# Altium schematic sheet MCU.SchDoc
size A; SheetNumber: 2; SheetTotal: 15
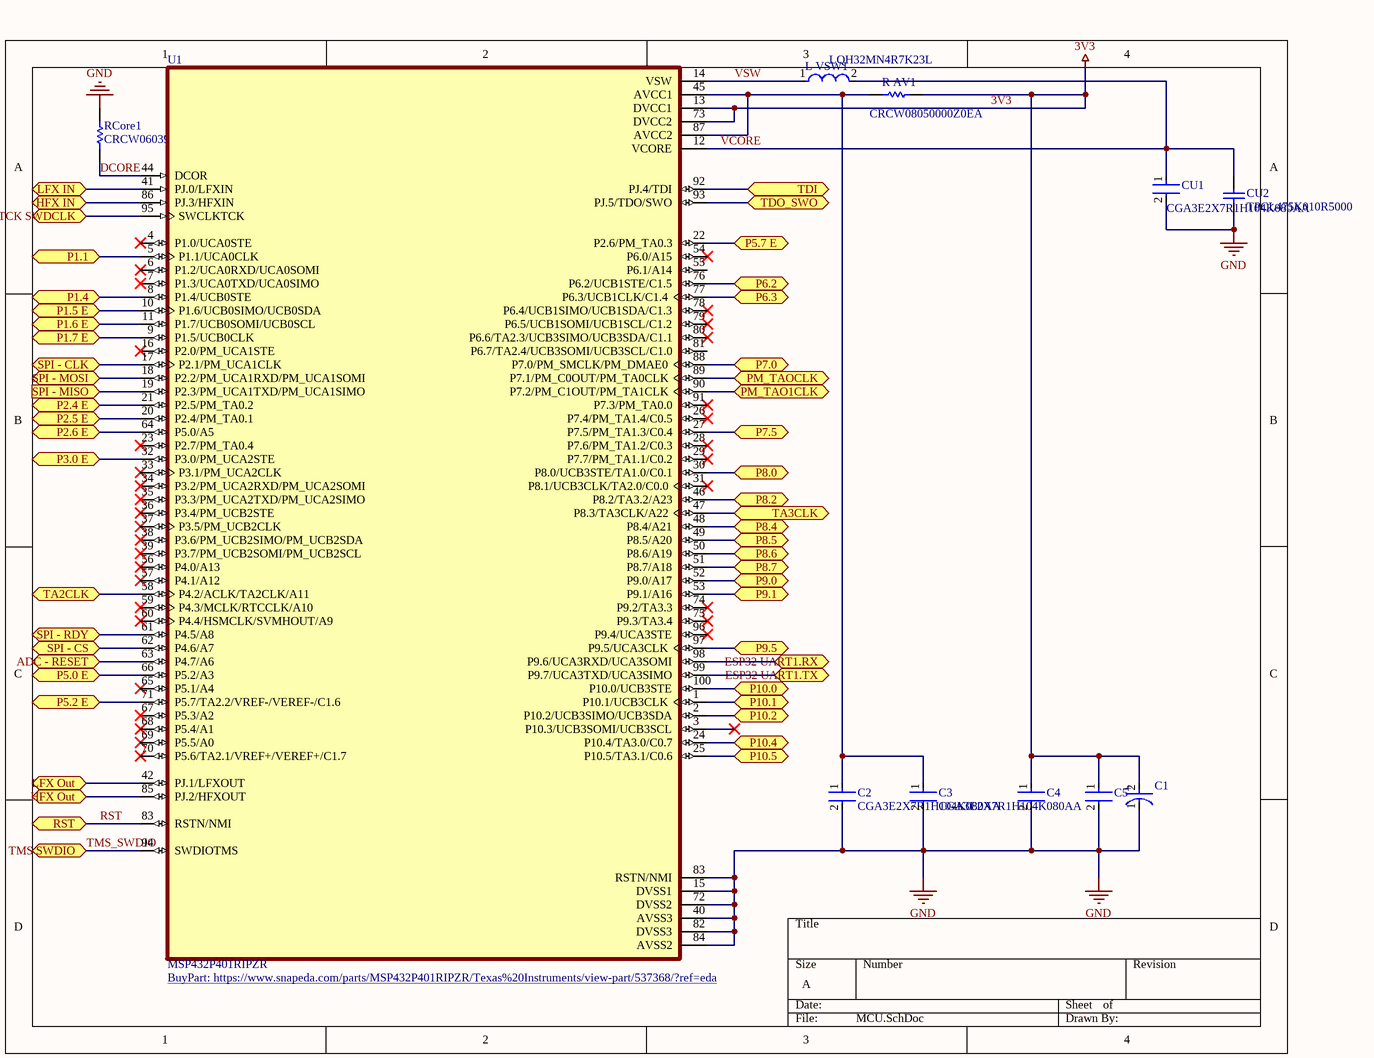
[diagram p0: MCU.SchDoc]

## Parts
C1  T520A106M010ATE080  [FP-T520A106M010ATE080-MFG]  (value not drawn)
C2  CGA3E2X7R1H104K080AA  [FP-CGA3E-0_3-0_1-IPC_A]
C3  CGA3E2X7R1H104K080AA  [FP-CGA3E-0_3-0_1-IPC_A]
C4  CGA3E2X7R1H104K080AA  [FP-CGA3E-0_3-0_1-IPC_A]  (value not drawn)
C5  CGA3E2X7R1H104K080AA  [FP-CGA3E-0_3-0_1-IPC_A]  (value not drawn)
CU1  CGA3E2X7R1H104K080AA  [FP-CGA3E-0_3-0_1-IPC_A]
CU2  TPCL475K010R5000  [CAPC1609X100X15LL20]
L_VSW1  LQH32MN4R7K23L  [FP-LQH32CH_23-MFG]
R_AV1  CRCW08050000Z0EA  [RESC2013X50X30LL20T20]
RCore1  CRCW060391K0FKEA  [RESC1609X50X30NL10T20]
U1  MSP432P401RIPZR  [QFP50P1600X1600X160-100N]

## Ports
ADC - RESET (bidir), ESP32 UART1.RX (bidir), ESP32 UART1.TX (bidir), HFX IN (bidir), HFX Out (bidir), LFX IN (bidir), LFX Out (bidir), P1.1 (bidir), P1.4 (bidir), P1.5 E (bidir), P1.6 E (bidir), P1.7 E (bidir), P2.4 E (bidir), P2.5 E (bidir), P2.6 E (bidir), P3.0 E (bidir), P5.0 E (bidir), P5.2 E (bidir), P5.7 E (bidir), P6.2 (bidir), P6.3 (bidir), P7.0 (bidir), P7.5 (bidir), P8.0 (bidir), P8.2 (bidir), P8.4 (bidir), P8.5 (bidir), P8.6 (bidir), P8.7 (bidir), P9.0 (bidir), P9.1 (bidir), P9.5 (bidir), P10.0 (bidir), P10.1 (bidir), P10.2 (bidir), P10.4 (bidir), P10.5 (bidir), PM_TAO1CLK (bidir), PM_TAOCLK (bidir), RST (bidir), SPI - CLK (bidir), SPI - CS (bidir), SPI - MISO (in), SPI - MOSI (bidir), SPI - RDY (bidir), TA2CLK (bidir), TA3CLK (bidir), TCK SWDCLK (bidir), TDI (bidir), TDO_SWO (bidir), TMS SWDIO (bidir)

## Nets
3V3: C1.2(A) C4.1 C5.1 R_AV1.2 U1.13(DVCC1) U1.73(DVCC2)
GND: C1.1(C) C2.2 C3.2 C4.2 C5.2 CU1.2 CU2.1 RCore1.1 U1.15(DVSS1) U1.40(AVSS3) U1.72(DVSS2) U1.82(DVSS3) U1.83(RSTN/NMI) U1.84(AVSS2)
\: U1.3(P10.3/UCB3SOMI/UCB3SCL)
ADC - RESET: U1.63(P4.7/A6) ; port ADC - RESET
DCORE: RCore1.2 U1.44(DCOR)
ESP32 UART1.RX: U1.98(P9.6/UCA3RXD/UCA3SOMI) ; port ESP32 UART1.RX
ESP32 UART1.TX: U1.99(P9.7/UCA3TXD/UCA3SIMO) ; port ESP32 UART1.TX
HFX IN: U1.86(PJ.3/HFXIN) ; port HFX IN
HFX Out: U1.85(PJ.2/HFXOUT) ; port HFX Out
LFX IN: U1.41(PJ.0/LFXIN) ; port LFX IN
LFX Out: U1.42(PJ.1/LFXOUT) ; port LFX Out
P1.1: U1.5(P1.1/UCA0CLK) ; port P1.1
P1.4: U1.8(P1.4/UCB0STE) ; port P1.4
P1.5 E: U1.10(P1.6/UCB0SIMO/UCB0SDA) ; port P1.5 E
P1.6 E: U1.11(P1.7/UCB0SOMI/UCB0SCL) ; port P1.6 E
P1.7 E: U1.9(P1.5/UCB0CLK) ; port P1.7 E
P2.4 E: U1.21(P2.5/PM_TA0.2) ; port P2.4 E
P2.5 E: U1.20(P2.4/PM_TA0.1) ; port P2.5 E
P2.6 E: U1.64(P5.0/A5) ; port P2.6 E
P3.0 E: U1.32(P3.0/PM_UCA2STE) ; port P3.0 E
P5.0 E: U1.66(P5.2/A3) ; port P5.0 E
P5.2 E: U1.71(P5.7/TA2.2/VREF-/VEREF-/C1.6) ; port P5.2 E
P5.7 E: U1.22(P2.6/PM_TA0.3) ; port P5.7 E
P6.2: U1.76(P6.2/UCB1STE/C1.5) ; port P6.2
P6.3: U1.77(P6.3/UCB1CLK/C1.4) ; port P6.3
P7.0: U1.88(P7.0/PM_SMCLK/PM_DMAE0) ; port P7.0
P7.5: U1.27(P7.5/PM_TA1.3/C0.4) ; port P7.5
P8.0: U1.30(P8.0/UCB3STE/TA1.0/C0.1) ; port P8.0
P8.2: U1.46(P8.2/TA3.2/A23) ; port P8.2
P8.4: U1.48(P8.4/A21) ; port P8.4
P8.5: U1.49(P8.5/A20) ; port P8.5
P8.6: U1.50(P8.6/A19) ; port P8.6
P8.7: U1.51(P8.7/A18) ; port P8.7
P9.0: U1.52(P9.0/A17) ; port P9.0
P9.1: U1.53(P9.1/A16) ; port P9.1
P9.5: U1.97(P9.5/UCA3CLK) ; port P9.5
P10.0: U1.100(P10.0/UCB3STE) ; port P10.0
P10.1: U1.1(P10.1/UCB3CLK) ; port P10.1
P10.2: U1.2(P10.2/UCB3SIMO/UCB3SDA) ; port P10.2
P10.4: U1.24(P10.4/TA3.0/C0.7) ; port P10.4
P10.5: U1.25(P10.5/TA3.1/C0.6) ; port P10.5
PM_TAO1CLK: U1.90(P7.2/PM_C1OUT/PM_TA1CLK) ; port PM_TAO1CLK
PM_TAOCLK: U1.89(P7.1/PM_C0OUT/PM_TA0CLK) ; port PM_TAOCLK
RST: U1.83(RSTN/NMI) ; port RST
SPI - CLK: U1.17(P2.1/PM_UCA1CLK) ; port SPI - CLK
SPI - CS: U1.62(P4.6/A7) ; port SPI - CS
SPI - MISO: U1.19(P2.3/PM_UCA1TXD/PM_UCA1SIMO) ; port SPI - MISO
SPI - MOSI: U1.18(P2.2/PM_UCA1RXD/PM_UCA1SOMI) ; port SPI - MOSI
SPI - RDY: U1.61(P4.5/A8) ; port SPI - RDY
TA2CLK: U1.58(P4.2/ACLK/TA2CLK/A11) ; port TA2CLK
TA3CLK: U1.47(P8.3/TA3CLK/A22) ; port TA3CLK
TCK SWDCLK: U1.95(SWCLKTCK) ; port TCK SWDCLK
TDI: U1.92(PJ.4/TDI) ; port TDI
TDO_SWO: U1.93(PJ.5/TDO/SWO) ; port TDO_SWO
TMS_SWDIO: U1.94(SWDIOTMS) ; port TMS SWDIO
VCORE: CU1.1 CU2.2 L_VSW1.2 U1.12(VCORE)
VSW: L_VSW1.1 U1.14(VSW)
NetC2_1: C2.1 C3.1 R_AV1.1 U1.45(AVCC1) U1.87(AVCC2)

Not connected (* = marked no-connect by the designer): U1 4(P1.0/UCA0STE)* 6(P1.2/UCA0RXD/UCA0SOMI)* 7(P1.3/UCA0TXD/UCA0SIMO)* 16(P2.0/PM_UCA1STE)* 23(P2.7/PM_TA0.4)* 26(P7.4/PM_TA1.4/C0.5)* 28(P7.6/PM_TA1.2/C0.3)* 29(P7.7/PM_TA1.1/C0.2)* 31(P8.1/UCB3CLK/TA2.0/C0.0)* 33(P3.1/PM_UCA2CLK)* 34(P3.2/PM_UCA2RXD/PM_UCA2SOMI)* 35(P3.3/PM_UCA2TXD/PM_UCA2SIMO)* 36(P3.4/PM_UCB2STE)* 37(P3.5/PM_UCB2CLK)* 38(P3.6/PM_UCB2SIMO/PM_UCB2SDA)* 39(P3.7/PM_UCB2SOMI/PM_UCB2SCL)* 54(P6.0/A15)* 55(P6.1/A14) 56(P4.0/A13)* 57(P4.1/A12)* 59(P4.3/MCLK/RTCCLK/A10)* 60(P4.4/HSMCLK/SVMHOUT/A9)* 65(P5.1/A4)* 67(P5.3/A2)* 68(P5.4/A1)* 69(P5.5/A0)* 70(P5.6/TA2.1/VREF+/VEREF+/C1.7)* 74(P9.2/TA3.3)* 75(P9.3/TA3.4)* 78(P6.4/UCB1SIMO/UCB1SDA/C1.3)* 79(P6.5/UCB1SOMI/UCB1SCL/C1.2)* 80(P6.6/TA2.3/UCB3SIMO/UCB3SDA/C1.1)* 81(P6.7/TA2.4/UCB3SOMI/UCB3SCL/C1.0) 91(P7.3/PM_TA0.0)* 96(P9.4/UCA3STE)*

## Notes on the sheet
- (in symbol CMP-03017-000030-1) +

## Library data of the parts
C1 = CMP-03017-000030-1: CAP TANT POLY 10UF 10V 1206; Tolerance: 20%; Dielectric Material: Tantalum; Dissipation Factor: 8%; Leakage Current: 10uA; Life (Hours): 2000Hour; ESR (Equivalent Series Resistance): 80mR; Polarity: Polar; Length: 3.2mm; Construction: Flat; Features: General Purpose; Voltage Rating: 10V; Capacitance: 10uF; Width: 1.6mm; Mount: Surface Mount; Packaging: Tape and Reel; Voltage Rating (DC): 10V; Max Operating Temperature: 105°C; Case Code (Metric): 3216; Package Quantity: 1; Height: 1.6mm; Voltage: 10V; Depth: 1.6mm; Height - Seated (Max): 0.071inch; Radiation Hardening: No; Case/Package: 1206; Termination: SMD/SMT; Case Code (Imperial): 1206; Series: KO-CAP T520; REACH SVHC: No SVHC; RoHS Compliant: Yes; Min Operating Temperature: -55°C; Lead Free: Lead Free
C2-C5 CU1 = CMP-2000-07546-2: Cap Ceramic 100nF 50V X7R 10% Pad SMD 0603 +125°C Automotive T/R; Weight: 7.1E-05oz; Composition: Ceramic; Max Operating Temperature: 125°C; Termination: SMD/SMT; Dielectric: X7R; Length: 1.6mm; Package Quantity: 1; REACH SVHC: No SVHC; Lead Free: Lead Free; Case Code (Metric): 1608; Min Operating Temperature: -55°C; Packaging: Tape and Reel; Tolerance: 10%; Voltage Rating: 50V; Case Code (Imperial): 0603; Capacitance: 100nF; Case/Package: 0603; Voltage Rating (DC): 50V; Depth: 0.8mm; Radiation Hardening: No; Ratings: AEC-Q200; Mount: Surface Mount; Voltage: 50V; Thickness: 0.035inch; Width: 0.8mm; Height: 0.8mm
CU2 = CMP-2006-00210-1: Manufacturer: AVX Interconnect / Elco; Part Number: TPCL475K010R5000
L_VSW1 = CMP-06042-008286-2: Wire Wound Ferrite Inductor for General Circuits 4.7μH ±10% 1.2Ω 270mA 1210; Series Resistance: 1.2R; Test Frequency: 1MHz; Frequency: 31MHz; Shielding: Unshielded; Inductance: 4.7uH; Q Factor: 20; Case/Package: 1210; Min Operating Temperature: -25°C; Case Code (Metric): 3225; Height - Seated (Max): 0.087inch; Max DC Current: 270mA; Current Rating: 270mA; Case Code (Imperial): 1210; Tolerance: 10%; Length: 3.2mm; Width: 2.5mm; Number of Pins: 2; Weight: 0.000564oz; Packaging: Tape and Reel; Core Material: Ferrite; Height: 2mm; Termination: SMD/SMT; Self Resonant Frequency: 31MHz; DC Current: 270mA; Max Operating Temperature: 85°C; Radiation Hardening: No; Lead Free: Lead Free; Inductor Type: Wirewound; Rated Current-Max: 270mA; Mount: Surface Mount; Inductance Tolerance: 10%; Resistor Type: Wirewound; Military Standard: Not; Package Quantity: 1; REACH SVHC: No SVHC; Series: LQH32M; Depth: 2.7mm; DC Resistance (DCR): 1.2R
R_AV1 = CMP-2001-04896-1: Manufacturer: Vishay Dale; Part Number: CRCW08050000Z0EA
RCore1 = CMP-2000-03640-1: Manufacturer: Vishay Dale; Part Number: CRCW060391K0FKEA
U1 = MSP432P401RIPZR: SimpleLink ultra-low-power 32-bit Arm Cortex-M4F MCU With Precision ADC, 256KB Flash and 64KB RAM 100-LQFP -40 to 85; MF: Texas Instruments; Mouser-Purchase-URL: https://snapeda.com/shop?store=Mouser&id=537368; SnapEDA_Link: https://www.snapeda.com/parts/MSP432P401RIPZR/Texas%20Instruments/view-part/537368/?ref=snap; Digi-Key_Part_Number: 296-44715-1-ND; Texas_Instruments-Purchase-URL: https://snapeda.com/shop?store=Texas+Instruments&id=537368; Value: *; Package: LQFP-100 Texas Instruments; MP: MSP432P401RIPZR; DigiKey-Purchase-URL: https://snapeda.com/shop?store=DigiKey&id=537368; BuyPart: https://www.snapeda.com/parts/MSP432P401RIPZR/Texas%20Instruments/view-part/537368/?ref=eda